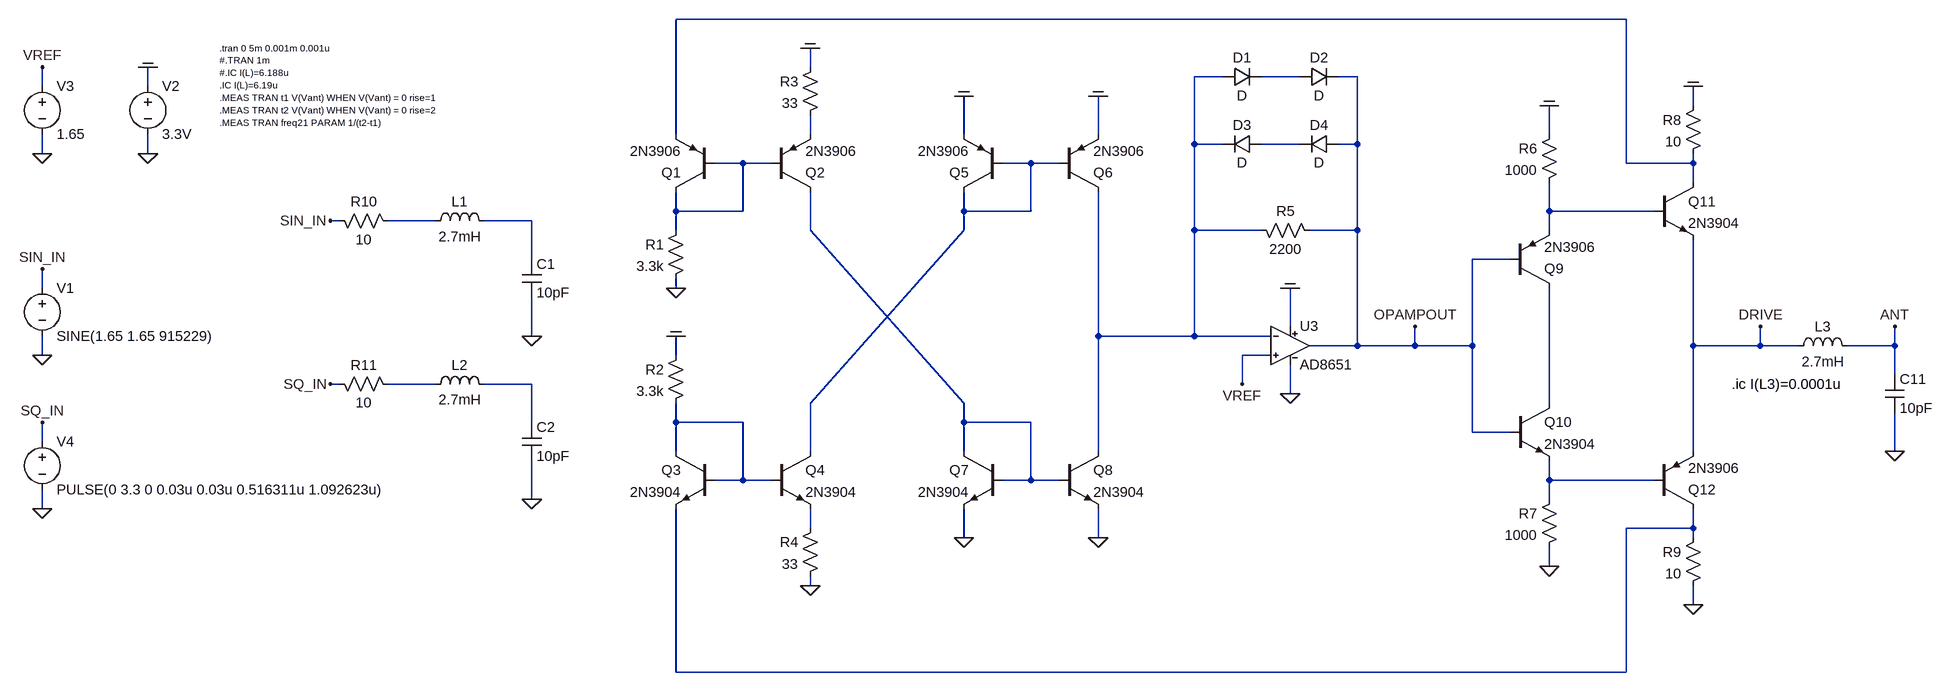
[diagram p0: schematic 2021_current_sensing_current_mirrors_oscillator_05.asc]
2021_current_sensing_current_mirrors_oscillator_05.asc, the LTspice schematic file:
Version 4
SHEET 1 8068 8692
WIRE 2704 -320 1120 -320
WIRE 1344 -240 1344 -272
WIRE 2032 -224 1984 -224
WIRE 2160 -224 2096 -224
WIRE 2256 -224 2224 -224
WIRE -448 -208 -448 -240
WIRE -272 -208 -272 -240
WIRE 2816 -176 2816 -208
WIRE 1120 -128 1120 -320
WIRE 1344 -128 1344 -160
WIRE 1600 -128 1600 -192
WIRE 1824 -128 1824 -192
WIRE 2576 -128 2576 -176
WIRE 1984 -112 1984 -224
WIRE 2032 -112 1984 -112
WIRE 2160 -112 2096 -112
WIRE 2256 -112 2256 -224
WIRE 2256 -112 2224 -112
WIRE -448 -96 -448 -128
WIRE -272 -96 -272 -128
WIRE 1232 -80 1184 -80
WIRE 1280 -80 1232 -80
WIRE 1712 -80 1664 -80
WIRE 1760 -80 1712 -80
WIRE 2704 -80 2704 -320
WIRE 2816 -80 2816 -96
WIRE 2816 -80 2704 -80
WIRE 2816 -48 2816 -80
WIRE 1120 0 1120 -32
WIRE 1232 0 1232 -80
WIRE 1232 0 1120 0
WIRE 1600 0 1600 -32
WIRE 1712 0 1712 -80
WIRE 1712 0 1600 0
WIRE 2576 0 2576 -48
WIRE 2752 0 2576 0
WIRE 48 16 32 16
WIRE 208 16 128 16
WIRE 368 16 288 16
WIRE 1120 32 1120 0
WIRE 1344 32 1344 -32
WIRE 1600 32 1600 0
WIRE 1984 32 1984 -112
WIRE 2096 32 1984 32
WIRE 2256 32 2256 -112
WIRE 2256 32 2176 32
WIRE 2576 32 2576 0
WIRE 368 80 368 16
WIRE 2512 80 2448 80
WIRE -448 128 -448 96
WIRE 1120 128 1120 112
WIRE 2144 192 2144 128
WIRE 368 208 368 144
WIRE 1824 208 1824 -32
WIRE 1984 208 1984 32
WIRE 1984 208 1824 208
WIRE 2112 208 1984 208
WIRE 2256 224 2256 32
WIRE 2256 224 2176 224
WIRE 2352 224 2352 192
WIRE 2352 224 2256 224
WIRE 2448 224 2448 80
WIRE 2448 224 2352 224
WIRE 2816 224 2816 48
WIRE 2928 224 2928 192
WIRE 2928 224 2816 224
WIRE 2992 224 2928 224
WIRE 3152 224 3152 192
WIRE 3152 224 3072 224
WIRE -448 240 -448 208
WIRE 1120 240 1120 208
WIRE 2112 240 2064 240
WIRE 3152 272 3152 224
WIRE 48 288 32 288
WIRE 208 288 128 288
WIRE 368 288 288 288
WIRE 2064 288 2064 240
WIRE 2144 304 2144 256
WIRE 1344 320 1600 32
WIRE 1600 320 1344 32
WIRE 2576 320 2576 128
WIRE 368 352 368 288
WIRE 1120 352 1120 320
WIRE 1232 352 1120 352
WIRE 1600 352 1600 320
WIRE 1712 352 1600 352
WIRE 2448 368 2448 224
WIRE 2512 368 2448 368
WIRE -448 384 -448 352
WIRE 1120 400 1120 352
WIRE 1344 400 1344 320
WIRE 1600 400 1600 352
WIRE 1824 400 1824 208
WIRE 2816 400 2816 224
WIRE 3152 400 3152 336
WIRE 1232 448 1232 352
WIRE 1232 448 1184 448
WIRE 1280 448 1232 448
WIRE 1712 448 1712 352
WIRE 1712 448 1664 448
WIRE 1760 448 1712 448
WIRE 2576 448 2576 416
WIRE 2752 448 2576 448
WIRE 368 480 368 416
WIRE 2576 480 2576 448
WIRE -448 496 -448 464
WIRE 1344 528 1344 496
WIRE 2816 528 2816 496
WIRE 2816 528 2704 528
WIRE 1600 544 1600 496
WIRE 1824 544 1824 496
WIRE 2816 544 2816 528
WIRE 2576 592 2576 560
WIRE 1344 624 1344 608
WIRE 2816 656 2816 624
WIRE 1120 768 1120 496
WIRE 2704 768 2704 528
WIRE 2704 768 1120 768
FLAG -448 240 0
FLAG 368 208 0
FLAG -272 -96 0
FLAG -272 -240 COM
FLAG -448 -96 0
FLAG -448 -240 VREF
FLAG -448 96 SIN_IN
FLAG 32 16 SIN_IN
FLAG -448 496 0
FLAG -448 352 SQ_IN
FLAG 368 480 0
FLAG 32 288 SQ_IN
FLAG 1120 208 COM
FLAG 1120 128 0
FLAG 1344 624 0
FLAG 1344 -272 COM
FLAG 1824 544 0
FLAG 1824 -192 COM
FLAG 1600 -192 COM
FLAG 1600 544 0
FLAG 2064 288 VREF
FLAG 3152 400 0
FLAG 3152 192 ANT
FLAG 2144 128 COM
FLAG 2144 304 0
FLAG 2576 592 0
FLAG 2576 -176 COM
FLAG 2816 -208 COM
FLAG 2816 656 0
FLAG 2928 192 DRIVE
FLAG 2352 192 OPAMPOUT
SYMBOL voltage -448 112 R0
WINDOW 123 0 0 Left 0
WINDOW 39 0 0 Left 0
SYMATTR InstName V1
SYMATTR Value SINE(1.65 1.65 915229)
SYMBOL ind 192 32 R270
WINDOW 0 32 56 VTop 2
WINDOW 3 5 56 VBottom 2
SYMATTR InstName L1
SYMATTR Value 2.7mH
SYMATTR SpiceLine Rser=120 Cpar=1.2pF
SYMBOL cap 352 80 R0
SYMATTR InstName C1
SYMATTR Value 10pF
SYMBOL res 144 32 M270
WINDOW 0 32 56 VTop 2
WINDOW 3 0 56 VBottom 2
SYMATTR InstName R10
SYMATTR Value 10
SYMBOL voltage -272 -224 R0
WINDOW 123 0 0 Left 2
WINDOW 39 0 0 Left 2
SYMATTR InstName V2
SYMATTR Value 3.3V
SYMBOL voltage -448 -224 R0
WINDOW 123 0 0 Left 0
WINDOW 39 0 0 Left 0
SYMATTR InstName V3
SYMATTR Value 1.65
SYMBOL voltage -448 368 R0
WINDOW 123 0 0 Left 0
WINDOW 39 0 0 Left 0
SYMATTR InstName V4
SYMATTR Value PULSE(0 3.3 0 0.03u 0.03u 0.516311u 1.092623u)
SYMBOL ind 192 304 R270
WINDOW 0 32 56 VTop 2
WINDOW 3 5 56 VBottom 2
SYMATTR InstName L2
SYMATTR Value 2.7mH
SYMATTR SpiceLine Rser=120 Cpar=1.2pF
SYMBOL cap 352 352 R0
SYMATTR InstName C2
SYMATTR Value 10pF
SYMBOL res 144 304 M270
WINDOW 0 32 56 VTop 2
WINDOW 3 0 56 VBottom 2
SYMATTR InstName R11
SYMATTR Value 10
SYMBOL npn 1280 400 R0
SYMATTR InstName Q4
SYMATTR Value 2N3904
SYMBOL npn 1184 400 M0
SYMATTR InstName Q3
SYMATTR Value 2N3904
SYMBOL pnp 1280 -32 M180
SYMATTR InstName Q2
SYMATTR Value 2N3906
SYMBOL pnp 1184 -32 R180
SYMATTR InstName Q1
SYMATTR Value 2N3906
SYMBOL res 1136 16 M0
WINDOW 0 36 40 Left 2
WINDOW 3 36 76 Left 2
SYMATTR InstName R1
SYMATTR Value 3.3k
SYMBOL res 1136 224 M0
WINDOW 0 36 40 Left 2
WINDOW 3 36 76 Left 2
SYMATTR InstName R2
SYMATTR Value 3.3k
SYMBOL res 1360 512 M0
WINDOW 0 36 40 Left 2
WINDOW 3 36 76 Left 2
SYMATTR InstName R4
SYMATTR Value 33
SYMBOL res 1360 -256 M0
WINDOW 0 36 40 Left 2
WINDOW 3 36 76 Left 2
SYMATTR InstName R3
SYMATTR Value 33
SYMBOL npn 1760 400 R0
SYMATTR InstName Q8
SYMATTR Value 2N3904
SYMBOL npn 1664 400 M0
SYMATTR InstName Q7
SYMATTR Value 2N3904
SYMBOL pnp 1760 -32 M180
SYMATTR InstName Q6
SYMATTR Value 2N3906
SYMBOL pnp 1664 -32 R180
SYMATTR InstName Q5
SYMATTR Value 2N3906
SYMBOL res 2192 48 M270
WINDOW 0 32 56 VTop 2
WINDOW 3 0 56 VBottom 2
SYMATTR InstName R5
SYMATTR Value 2200
SYMBOL ad8651 2144 160 R0
SYMATTR InstName U3
SYMBOL ind 2976 240 R270
WINDOW 0 32 56 VTop 2
WINDOW 3 5 56 VBottom 2
SYMATTR InstName L3
SYMATTR Value 2.7mH
SYMATTR SpiceLine Rser=120 Cpar=1.2pF
SYMBOL cap 3136 272 R0
SYMATTR InstName C11
SYMATTR Value 10pF
SYMBOL diode 2096 -128 R90
WINDOW 0 0 32 VBottom 2
WINDOW 3 32 32 VTop 2
SYMATTR InstName D3
SYMBOL diode 2224 -128 R90
WINDOW 0 0 32 VBottom 2
WINDOW 3 32 32 VTop 2
SYMATTR InstName D4
SYMBOL diode 2160 -208 R270
WINDOW 0 32 32 VTop 2
WINDOW 3 0 32 VBottom 2
SYMATTR InstName D2
SYMBOL diode 2032 -208 R270
WINDOW 0 32 32 VTop 2
WINDOW 3 0 32 VBottom 2
SYMATTR InstName D1
SYMBOL npn 2512 320 R0
SYMATTR InstName Q10
SYMATTR Value 2N3904
SYMBOL res 2592 464 M0
WINDOW 0 36 40 Left 2
WINDOW 3 36 76 Left 2
SYMATTR InstName R7
SYMATTR Value 1000
SYMBOL pnp 2512 128 M180
SYMATTR InstName Q9
SYMATTR Value 2N3906
SYMBOL res 2592 -144 M0
WINDOW 0 36 40 Left 2
WINDOW 3 36 76 Left 2
SYMATTR InstName R6
SYMATTR Value 1000
SYMBOL npn 2752 -48 R0
SYMATTR InstName Q11
SYMATTR Value 2N3904
SYMBOL pnp 2752 496 M180
SYMATTR InstName Q12
SYMATTR Value 2N3906
SYMBOL res 2832 -192 M0
WINDOW 0 36 40 Left 2
WINDOW 3 36 76 Left 2
SYMATTR InstName R8
SYMATTR Value 10
SYMBOL res 2832 528 M0
WINDOW 0 36 40 Left 2
WINDOW 3 36 76 Left 2
SYMATTR InstName R9
SYMATTR Value 10
TEXT -152 -272 Left 1 !.tran 0 5m 0.001m 0.001u\n#.TRAN 1m\n#.IC I(L)=6.188u\n.IC I(L)=6.19u\n.MEAS TRAN t1 V(Vant) WHEN V(Vant) = 0 rise=1\n.MEAS TRAN t2 V(Vant) WHEN V(Vant) = 0 rise=2\n.MEAS TRAN freq21 PARAM 1/(t2-t1)
TEXT 2880 288 Left 2 !.ic I(L3)=0.0001u

The netlist it stands for:
* 2021_current_sensing_current_mirrors_oscillator_05.asc
V1 SIN_IN 0 SINE(1.65 1.65 915229)
L1 N009 N010 2.7mH Rser=120 Cpar=1.2pF
C1 N010 0 10pF
R10 N009 SIN_IN 10
V2 COM 0 3.3V
V3 VREF 0 1.65
V4 SQ_IN 0 PULSE(0 3.3 0 0.03u 0.03u 0.516311u 1.092623u)
L2 N012 N013 2.7mH Rser=120 Cpar=1.2pF
C2 N013 0 10pF
R11 N012 SQ_IN 10
Q4 N007 N015 N017 0 2N3904
Q3 N015 N015 N018 0 2N3904
Q2 N011 N006 N004 0 2N3906
Q1 N006 N006 N001 0 2N3906
R1 N006 0 3.3k
R2 COM N015 3.3k
R4 N017 0 33
R3 COM N004 33
Q8 N002 N011 0 0 2N3904
Q7 N011 N011 0 0 2N3904
Q6 N002 N007 COM 0 2N3906
Q5 N007 N007 COM 0 2N3906
R5 OPAMPOUT N002 2200
XU3 VREF N002 COM 0 OPAMPOUT AD8651  ; pins In+ In- V+ V- OUT
L3 DRIVE ANT 2.7mH Rser=120 Cpar=1.2pF
C11 ANT 0 10pF
D3 N005 N002 D
D4 OPAMPOUT N005 D
D2 N003 OPAMPOUT D
D1 N002 N003 D
Q10 N014 OPAMPOUT N016 0 2N3904
R7 N016 0 1000
Q9 N014 OPAMPOUT N008 0 2N3906
R6 COM N008 1000
Q11 N001 N008 DRIVE 0 2N3904
Q12 N018 N016 DRIVE 0 2N3906
R8 COM N001 10
R9 N018 0 10
.model D D
.lib standard.dio
.model NPN NPN
.model PNP PNP
.lib standard.bjt
.tran 0 5m 0.001m 0.001u
#.TRAN 1m
#.IC I(L)=6.188u
.IC I(L)=6.19u
.MEAS TRAN t1 V(Vant) WHEN V(Vant) = 0 rise=1
.MEAS TRAN t2 V(Vant) WHEN V(Vant) = 0 rise=2
.MEAS TRAN freq21 PARAM 1/(t2-t1)
.ic I(L3)=0.0001u
.lib ad8651.cir
.backanno
.end